# EAGLE design PIC28schematic (EAGLE 5.12)
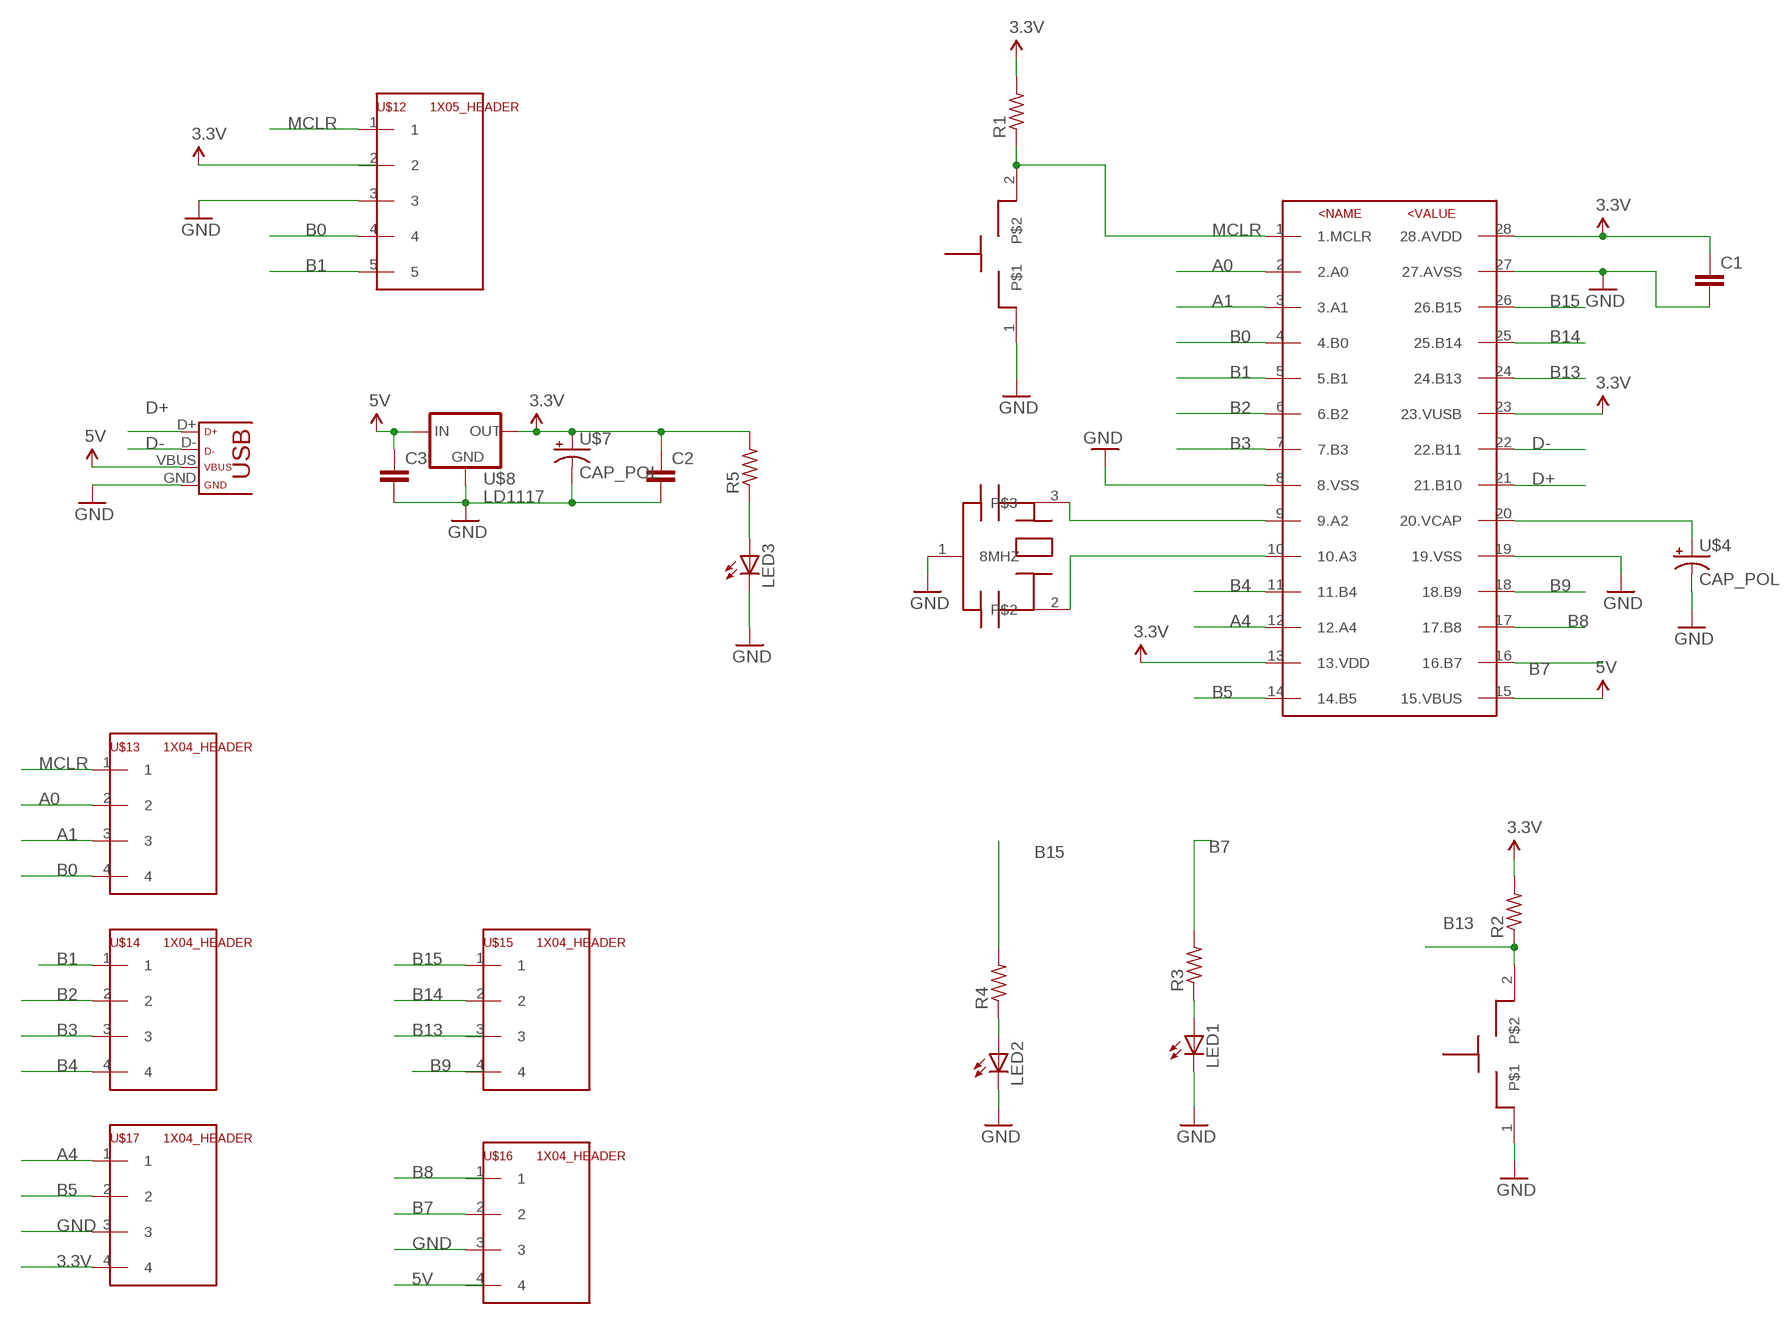
[diagram p0: schematic, sheet 1]

## Parts
C1  C-EU025-030X050  [C025-030X050]
C2  C-EU025-024X044  [C025-024X044]
C3  C-EU025-024X044  [C025-024X044]
LED1  LED3MM  [LED3MM]
LED2  LED3MM  [LED3MM]
LED3  LED3MM  [LED3MM]
R1  R-US_0204/7  [0204/7]
R2  R-US_0204/7  [0204/7]
R3  R-US_0204/7  [0204/7]
R4  R-US_0204/7  [0204/7]
R5  R-US_0204/7  [0204/7]
U$1  PIC28  [DIL28-3]
U$2  PUSHBUTTON2  [1X03]
U$3  8MHZ  [1X03]
U$4  CAP_POL  [CAP_POL_D]
U$6  PUSHBUTTON  [1X04]
U$7  CAP_POL  [CAP_POL_D]
U$8  LD1117  [TO220]
U$10  USB  [USB-MINIB]
U$12  1X05_HEADER  [1X05]
U$13  1X04_HEADER  [1X04]
U$14  1X04_HEADER  [1X04]
U$15  1X04_HEADER  [1X04]
U$16  1X04_HEADER  [1X04]
U$17  1X04_HEADER  [1X04]

## Nets
3.3V: C1.1 C2.1 R1.2 R2.2 R5.2 U$1.13(13.VDD) U$1.23(23.VUSB) U$1.28(28.AVDD) U$7.1(+) U$8.2(OUT) U$17.4
5V: C3.1 U$1.15(15.VBUS) U$8.3(IN) U$10.VBUS
A0: U$1.2(2.A0) U$13.2
A1: U$1.3(3.A1) U$13.3
A4: U$1.12(12.A4) U$17.1
B0: U$1.4(4.B0) U$12.4 U$13.4
B1: U$1.5(5.B1) U$12.5 U$14.1
B2: U$1.6(6.B2) U$14.2
B3: U$1.7(7.B3) U$14.3
B4: U$1.11(11.B4) U$14.4
B5: U$1.14(14.B5) U$17.2
B7: R3.2 U$1.16(16.B7) U$16.2
B8: U$1.17(17.B8)
B9: U$1.18(18.B9)
B13: R2.1 U$1.24(24.B13) U$6.2
B14: U$1.25(25.B14) U$15.2
B15: R4.2 U$1.26(26.B15) U$15.1
D+: U$1.21(21.B10) U$10.D+
D-: U$1.22(22.B11) U$10.D-
GND: C1.2 C2.2 C3.2 LED1.K(C) LED2.K(C) LED3.K(C) U$1.8(8.VSS) U$1.19(19.VSS) U$1.27(27.AVSS) U$2.1 U$3.1(8MHZ) U$4.2(-) U$6.1 U$7.2(-) U$8.1(GND) U$10.GND U$12.3 U$16.3 U$17.3
MCLR: R1.1 U$1.1(1.MCLR) U$2.2 U$12.1 U$13.1
N$3: U$1.9(9.A2) U$3.3
N$10: U$1.10(10.A3) U$3.2
N$19: U$1.20(20.VCAP) U$4.1(+)
N$25: LED1.A R3.1
N$28: LED2.A R4.1
N$30: LED3.A R5.1
Unconnected: U$12.2 U$15.3 U$15.4 U$16.1 U$16.4

## Library data of the parts
C1-C3 = ME433:C-EU: CAPACITOR, European symbol
LED1-LED3 = ME433:LED: LED OSRAM: - CHIPLED LG R971, LG N971, LY N971, LG Q971, LY Q971, LO R971, LY R971 LH N974, LH R974 LS Q976, LO Q976, LY Q976 LO Q996 - Hyper CHIPLED LW Q18S LB Q993, LB Q99A, LB R99A - SideLED LS A670, LO A670, LY A670, LG A670, LP A670 LB A673, LV A673, LT A673, LW A673 LH A674 LY A675 LS A676, LA A676, LO A676, LY A676, LW A676 LS A679, LY A679, LG A679 - Hyper Micro SIDELED® LS Y876, LA Y876, LO Y876, LY Y876 LT Y87S - SmartLED LW L88C, LW L88S LB L89C, LB L89S, LG L890 LS L89K, LO L89K, LY L89K LS L896, LA L896, LO L896, LY L896 - TOPLED LS T670, LO T670, LY T670, LG T670, LP T670 LSG T670, LSP T670, LSY T670, LOP T670, LYG T670 LG T671, LOG T671, LSG T671 LB T673, LV T673, LT T673, LW T673 LH T674 LS T676, LA T676, LO T676, LY T676, LB T676, LH T676, LSB T676, LW T676 LB T67C, LV T67C, LT T67C, LS T67K, LO T67K, LY T67K, LW E67C LS E67B, LA E67B, LO E67B, LY E67B, LB E67C, LV E67C, LT E67C LW T67C LS T679, LY T679, LG T679 LS T770, LO T770, LY T770, LG T770, LP T770 LB T773, LV T773, LT T773, LW T773 LH T774 LS E675, LA E675, LY E675, LS T675 LS T776, LA T776, LO T776, LY T776, LB T776 LHGB T686 LT T68C, LB T68C - Hyper Mini TOPLED® LB M676 - Mini TOPLED Santana® LG M470 LS M47K, LO M47K, LY M47K Source: http://www.osram.convergy.de LUXEON: - LUMILED® LXK2-PW12-R00, LXK2-PW12-S00, LXK2-PW14-U00, LXK2-PW14-V00 LXK2-PM12-R00, LXK2-PM12-S00, LXK2-PM14-U00 LXK2-PE12-Q00, LXK2-PE12-R00, LXK2-PE12-S00, LXK2-PE14-T00, LXK2-PE14-U00 LXK2-PB12-K00, LXK2-PB12-L00, LXK2-PB12-M00, LXK2-PB14-N00, LXK2-PB14-P00, LXK2-PB14-Q00 LXK2-PR12-L00, LXK2-PR12-M00, LXK2-PR14-Q00, LXK2-PR14-R00 LXK2-PD12-Q00, LXK2-PD12-R00, LXK2-PD12-S00 LXK2-PH12-R00, LXK2-PH12-S00 LXK2-PL12-P00, LXK2-PL12-Q00, LXK2-PL12-R00 Source: www.luxeon.com KINGBRIGHT: KA-3528ASYC Source: www.kingbright.com
R1-R5 = ME433:R-US_: RESISTOR, American symbol
U$1 = ME433:PIC28
U$2 = ME433:PUSHBUTTON2
U$3 = ME433:8MHZ
U$4 U$7 = ME433:CAP_POL
U$6 = ME433:PUSHBUTTON
U$8 = ME433:LD1117
U$10 = ME433:USB
U$12 = ME433:1X05_HEADER
U$13-U$17 = ME433:1X04_HEADER

## Board
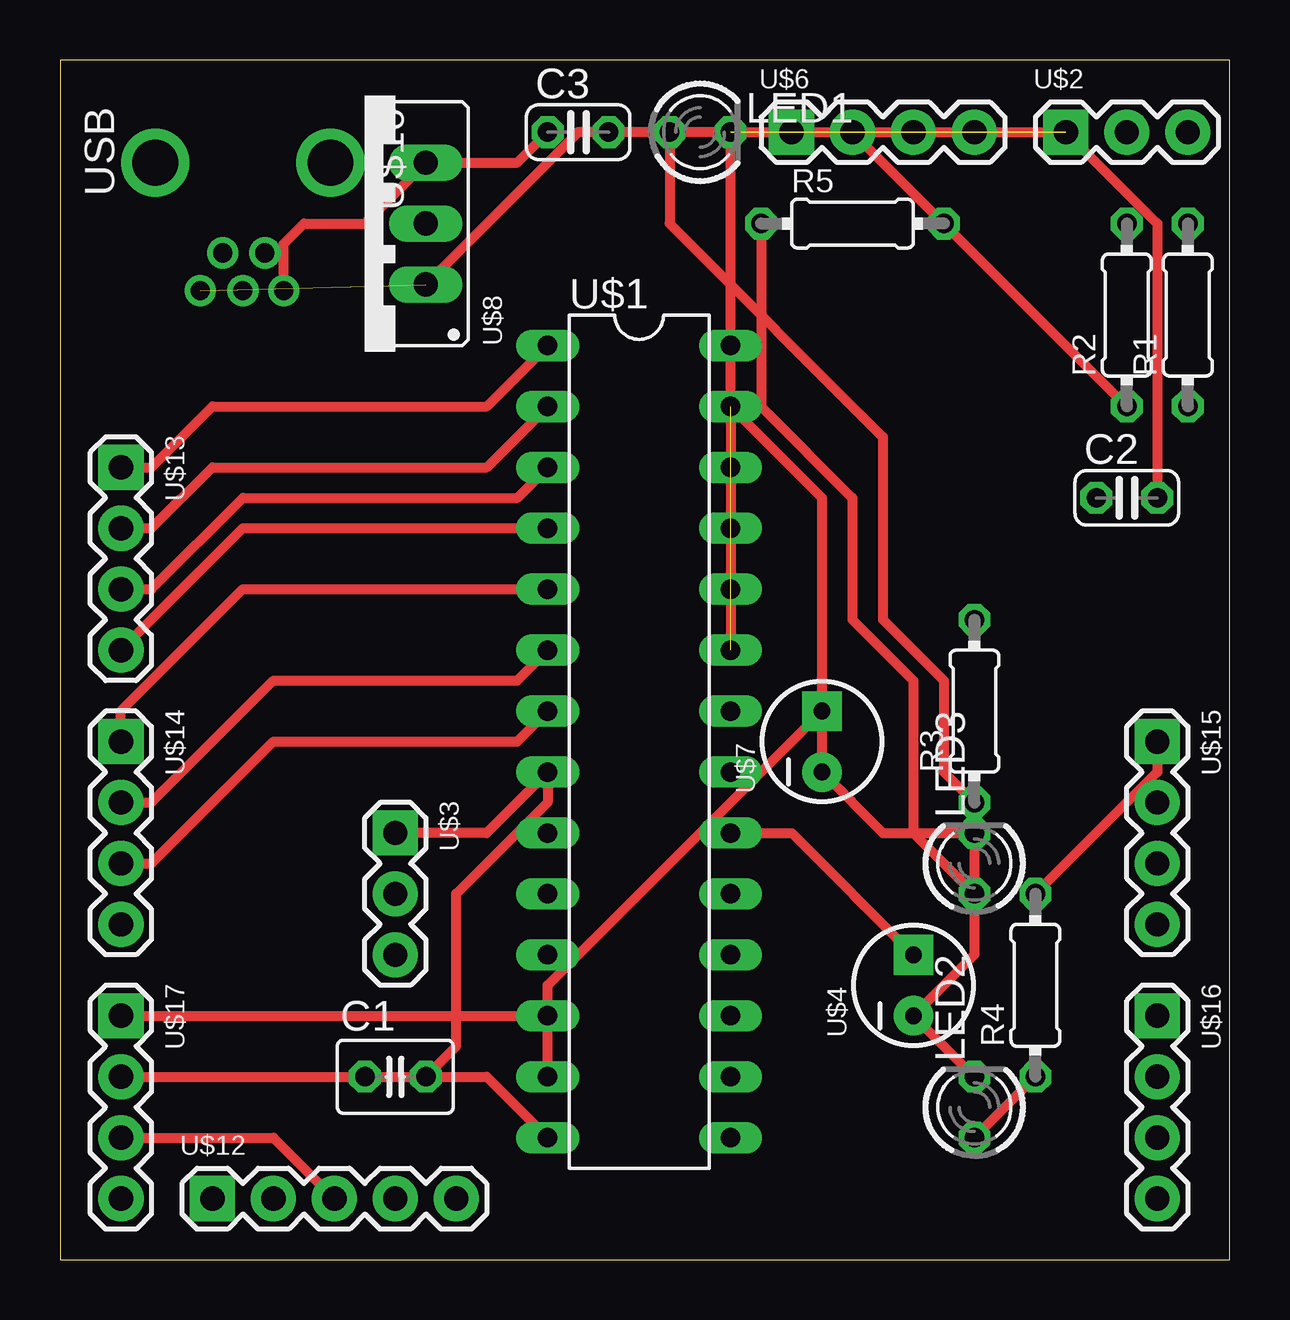
[diagram p1: board, top side]
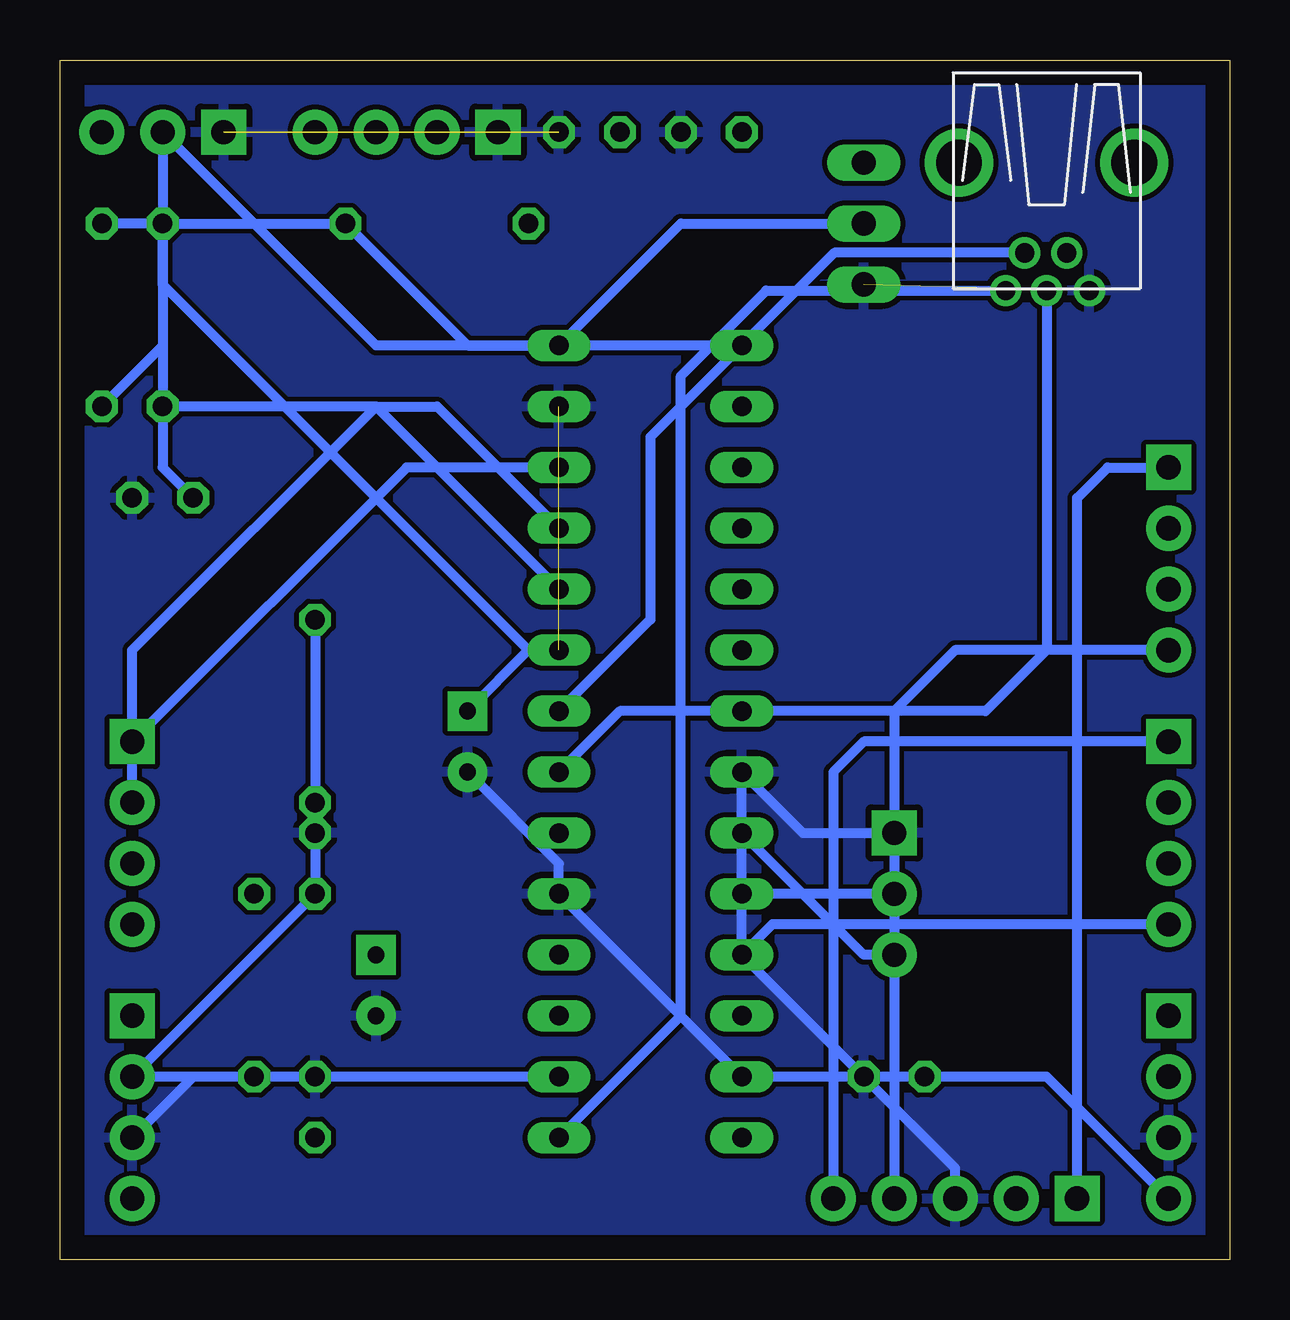
[diagram p2: board, bottom side, seen from below]

Size 48.73 x 50 mm. Coordinates in mm from the lower left corner, seen from the top.
Outline: 0,0 48.73,0 48.73,50 0,50 0,0
Copper layers (1*16): Top 0.035mm / dielectric 1.5mm / Bottom 0.035mm
Design rules "default": minimum track width 10mil, minimum drill 24mil, track to track 8mil, track to pad 8mil, pad to pad 8mil, via to via 8mil, smd to smd 8mil, copper to edge 40mil, drill to drill 8mil, minimum pad ring 10mil, minimum via ring 8mil, stop-mask expansion 4mil, vias tented up to drill 0mil, thermal gap 10mil

### Footprints (pad centres in the part's own frame; a part is rotated, then mirrored left to right if it is on the bottom)
C025-030X050 = drill 0.813 octagon: 1 -1.27,0; 2 1.27,0
C025-024X044 = drill 0.813 octagon: 1 -1.27,0; 2 1.27,0
LED3MM = drill 0.813 octagon: A -1.27,0; K 1.27,0
0204/7 = drill 0.813 octagon: 1 -3.81,0; 2 3.81,0
DIL28-3 = drill 0.813 long: 1 -16.51,-3.81; 2 -13.97,-3.81; 3 -11.43,-3.81; 4 -8.89,-3.81; 5 -6.35,-3.81; 6 -3.81,-3.81; 7 -1.27,-3.81; 8 1.27,-3.81; 9 3.81,-3.81; 10 6.35,-3.81; 11 8.89,-3.81; 12 11.43,-3.81; 13 13.97,-3.81; 14 16.51,-3.81; 15 16.51,3.81; 16 13.97,3.81; 17 11.43,3.81; 18 8.89,3.81; 19 6.35,3.81; 20 3.81,3.81; 21 1.27,3.81; 22 -1.27,3.81; 23 -3.81,3.81; 24 -6.35,3.81; 25 -8.89,3.81; 26 -11.43,3.81; 27 -13.97,3.81; 28 -16.51,3.81
1X03 = drill 1.016 pad 1.88 square: 1 0,0 | drill 1.016 pad 1.88 round: 2 2.54,0; 3 5.08,0
CAP_POL_D = drill 0.7 pad 1.651 square: 1 1.27,0 | drill 0.7 pad 1.651 round: 2 -1.27,0
1X04 = drill 1.016 pad 1.88 square: 1 0,0 | drill 1.016 pad 1.88 round: 2 2.54,0; 3 5.08,0; 4 7.62,0
TO220 = drill 1.016 long: 1 -2.54,0; 2 0,0; 3 2.54,0
USB-MINIB = drill 0.8 round: D+ 4.064,0; D- 2.489,0.914; GND 4.064,-1.778; ID 2.489,-0.838; VBUS 4.064,1.702 | drill 1.9 round: P$6 -1.27,-3.65; P$7 -1.27,3.65
1X05 = drill 1.016 pad 1.88 square: 1 0,0 | drill 1.016 pad 1.88 round: 2 2.54,0; 3 5.08,0; 4 7.62,0; 5 10.16,0

### Placement (x,y rotation side)
C1  13.97,7.62 0 top
C2  44.45,31.75 0 top
C3  21.59,46.99 0 top
LED1  26.67,46.99 0 top
LED2  38.1,6.35 90 top
LED3  38.1,16.51 90 top
R1  46.99,39.37 90 top
R2  44.45,39.37 90 top
R3  38.1,22.86 90 top
R4  40.64,11.43 90 top
R5  33.02,43.18 0 top
U$1  24.13,21.59 270 top
U$2  41.91,46.99 0 top
U$3  13.97,17.78 270 top
U$4  35.56,11.43 90 top
U$6  30.48,46.99 0 top
U$7  31.75,21.59 90 top
U$8  15.24,43.18 90 top
U$10  7.62,44.45 270 top
U$12  6.35,2.54 0 top
U$13  2.54,33.02 270 top
U$14  2.54,21.59 270 top
U$15  45.72,21.59 270 top
U$16  45.72,10.16 270 top
U$17  2.54,10.16 270 top

### Tracks (layer width: path | path; a pad name or v marks a point on that pad's centre or on a via)
3.3V
  Top 0.406: U$1.13 20.32,11.43 U$7.1
  Bottom 0.406: U$17.4 7.62,7.62 C1.1 U$1.13 | U$8.2 22.86,43.18 U$1.28 31.75,38.1 R5.2 R2.2 | 29.21,25.4 U$1.23 | U$7.1 29.21,25.4 | R2.2 R1.2 | R2.2 44.45,33.02 C2.1 | R2.2 44.45,40.64 29.21,25.4
5V
  Top 0.406: U$10.VBUS 9.32,42.34 10.16,43.18 12.7,43.18 U$8.3 19.05,45.72 C3.1
  Bottom 0.406: U$10.VBUS 19.3,40.39 22.86,36.83 22.86,10.16 U$1.15
A0
  Top 0.406: U$13.2 3.81,30.48 6.35,33.02 17.78,33.02 U$1.2
A1
  Top 0.406: U$13.3 3.81,27.94 7.62,31.75 19.05,31.75 U$1.3
A4
  Top 0.406: U$17.1 U$1.12
B0
  Top 0.406: U$13.4 7.62,30.48 U$1.4
  Bottom 0.406: U$13.4 11.43,25.4 13.97,22.86 U$12.4
B1
  Top 0.406: U$14.1 2.54,22.86 7.62,27.94 U$1.5
  Bottom 0.406: U$14.1 15.24,21.59 16.51,20.32 U$12.5
B2
  Top 0.406: U$14.2 3.81,19.05 8.89,24.13 19.05,24.13 U$1.6
B3
  Top 0.406: U$14.3 3.81,16.51 8.89,21.59 19.05,21.59 U$1.7
B4
  Bottom 0.406: U$14.4 19.05,13.97 U$1.11
B5
  Top 0.406: U$17.2 17.78,7.62 U$1.14
B7
  Bottom 0.406: U$1.16 U$16.2 38.1,15.24 R3.2
B13
  Top 0.406: U$6.2 R2.1
  Bottom 0.406: R2.1 35.56,35.56 U$1.24
B14
  Bottom 0.406: U$15.2 45.72,25.4 35.56,35.56 33.02,35.56 U$1.25
B15
  Top 0.406: U$15.1 45.72,20.32 R4.2
  Bottom 0.406: U$1.26 34.29,33.02 U$15.1
D+
  Bottom 0.406: U$10.D+ 7.62,25.4 10.16,22.86 25.4,22.86 U$1.21
D-
  Bottom 0.406: U$10.D- 16.46,41.96 24.13,34.29 24.13,26.67 U$1.22
GND  (5 unrouted)
  Top 0.406: U$17.3 8.89,5.08 U$12.3 | U$3.1 17.78,17.78 U$1.8 20.32,19.05 16.51,15.24 16.51,8.89 C1.2 | U$8.1 21.59,46.99 C3.2 LED1.K | LED1.K U$2.1 45.72,43.18 C2.2 | U$1.27 27.94,25.4 | U$1.27 LED1.K | U$1.27 31.75,31.75 U$7.2 34.29,17.78 LED3.K 38.1,12.7 U$4.2 LED2.K
  Bottom 0.406: U$12.3 11.43,3.81 C1.2 | C1.2 20.32,7.62 U$1.19 27.94,16.51 U$7.2 | LED2.K 43.18,7.62 U$16.3 | C1.2 20.32,12.7 U$1.8 17.78,17.78 U$3.1
  pour Bottom: 2.54,49.53 0,49.53 0,0 49.53,0 49.53,21.59 48.26,21.59 48.26,49.53
MCLR
  Top 0.406: U$13.1 3.81,33.02 6.35,35.56 17.78,35.56 U$1.1
  Bottom 0.406: U$13.1 5.08,33.02 6.35,31.75 U$12.1 | U$1.1 35.56,38.1 U$2.2 44.45,38.1 R1.1
N$3
  Bottom 0.406: U$3.3 15.24,12.7 U$1.9
N$10
  Bottom 0.406: U$3.2 U$1.10
N$19
  Top 0.406: U$1.20 30.48,17.78 U$4.1
N$25
  Top 0.406: LED1.A 25.4,43.18 34.29,34.29 34.29,26.67 36.83,24.13 36.83,20.32 R3.1
N$28
  Top 0.406: R4.1 LED2.A
N$30
  Top 0.406: R5.1 29.21,35.56 33.02,31.75 33.02,26.67 35.56,24.13 35.56,17.78 LED3.A